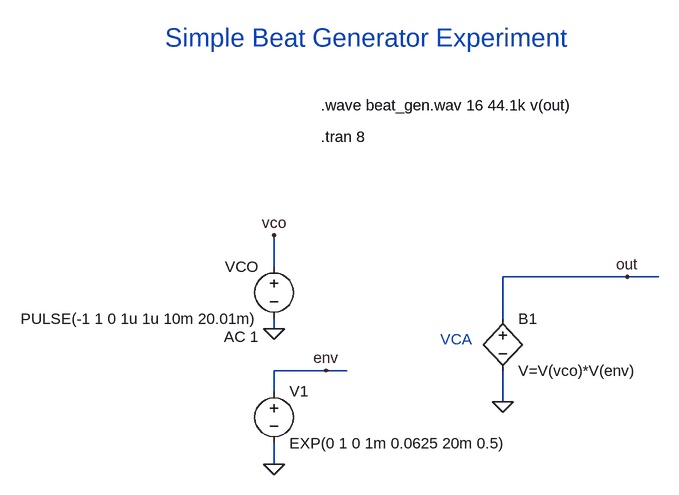
[diagram p0: schematic beat_gen.asc]
beat_gen.asc, the LTspice schematic file:
Version 4
SHEET 1 1536 820
WIRE -1248 32 -1248 -16
WIRE -704 48 -896 48
WIRE -656 48 -704 48
WIRE -896 112 -896 48
WIRE -1248 128 -1248 112
WIRE -1168 192 -1248 192
WIRE -1136 192 -1168 192
WIRE -1248 224 -1248 192
WIRE -896 240 -896 192
WIRE -1248 336 -1248 304
FLAG -1248 128 0
FLAG -1248 -16 vco
FLAG -704 48 out
FLAG -896 240 0
FLAG -1248 336 0
FLAG -1168 192 env
SYMBOL voltage -1248 16 M0
WINDOW 123 24 124 Left 2
WINDOW 39 0 0 Left 2
SYMATTR Value2 AC 1
SYMATTR InstName VCO
SYMATTR Value PULSE(-1 1 0 1u 1u 10m 20.01m)
SYMBOL bv -896 96 R0
SYMATTR InstName B1
SYMATTR Value V=V(vco)*V(env)
SYMBOL voltage -1248 208 R0
WINDOW 123 0 0 Left 0
WINDOW 39 0 0 Left 0
SYMATTR InstName V1
SYMATTR Value EXP(0 1 0 1m 0.0625 20m 0.5)
TEXT -1176 -168 Left 2 !.tran 8
TEXT -1416 -320 Left 4 ;Simple Beat Generator Experiment
TEXT -1176 -216 Left 2 !.wave beat_gen.wav 16 44.1k v(out)
TEXT -992 144 Left 2 ;VCA

The netlist it stands for:
* beat_gen.asc
VCO vco 0 PULSE(-1 1 0 1u 1u 10m 20.01m) AC 1
B1 out 0 V=V(vco)*V(env)
V1 env 0 EXP(0 1 0 1m 0.0625 20m 0.5)
.tran 8
* Simple Beat Generator Experiment
.wave beat_gen.wav 16 44.1k v(out)
* VCA
.backanno
.end